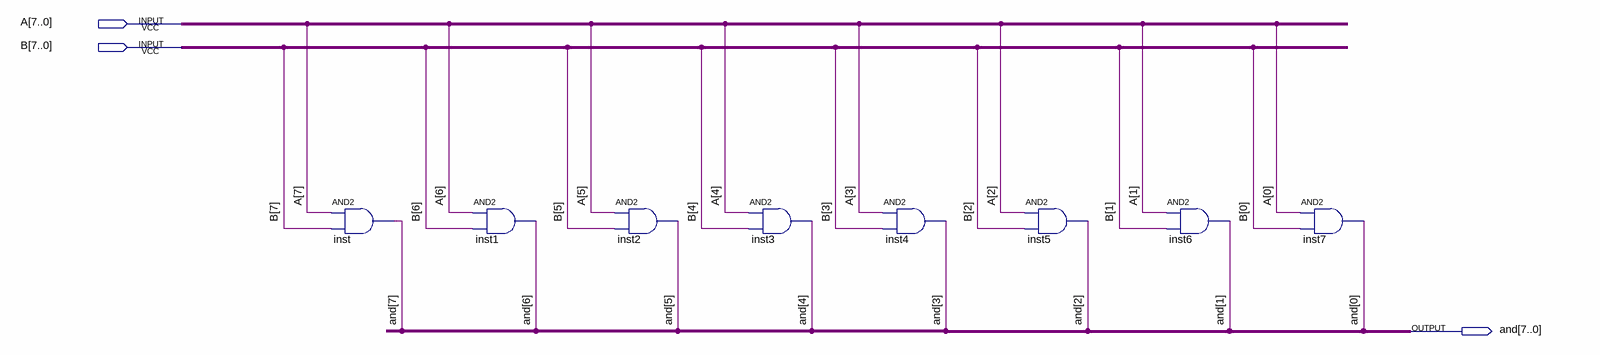
[diagram p0: schematic sheet]
// Quartus schematic and_logic8bit.bdf as structural Verilog: 8 symbols, 3 pins
module and_logic8bit (
  input  [7:0] A,
  input  [7:0] B,
  output [7:0] \and 
);

  and inst (\and [7], A[7], B[7]);
  and inst1 (\and [6], A[6], B[6]);
  and inst2 (\and [5], A[5], B[5]);
  and inst3 (\and [4], A[4], B[4]);
  and inst4 (\and [3], A[3], B[3]);
  and inst5 (\and [2], A[2], B[2]);
  and inst6 (\and [1], A[1], B[1]);
  and inst7 (\and [0], A[0], B[0]);
endmodule
